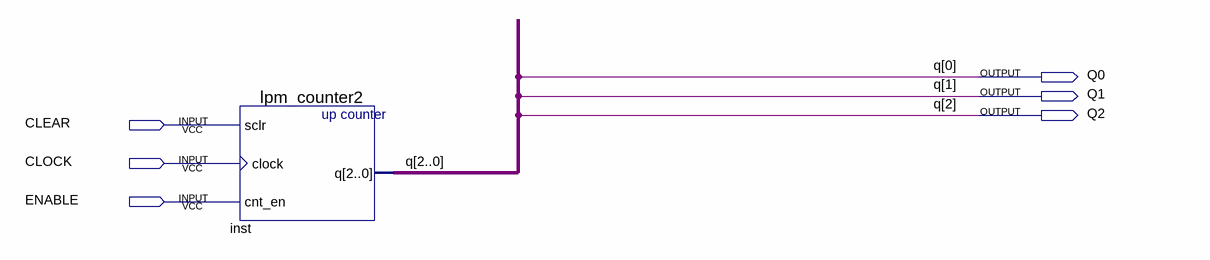
[diagram p0: schematic sheet]
// Quartus schematic cont4.bdf as structural Verilog: 1 symbols, 6 pins
module cont4 (
  input  CLEAR,
  input  CLOCK,
  input  ENABLE,
  output Q0,
  output Q1,
  output Q2
);

  lpm_counter2 inst (.sclr(CLEAR), .clock(CLOCK), .cnt_en(ENABLE), .q({Q2, Q1, Q0}));
endmodule
